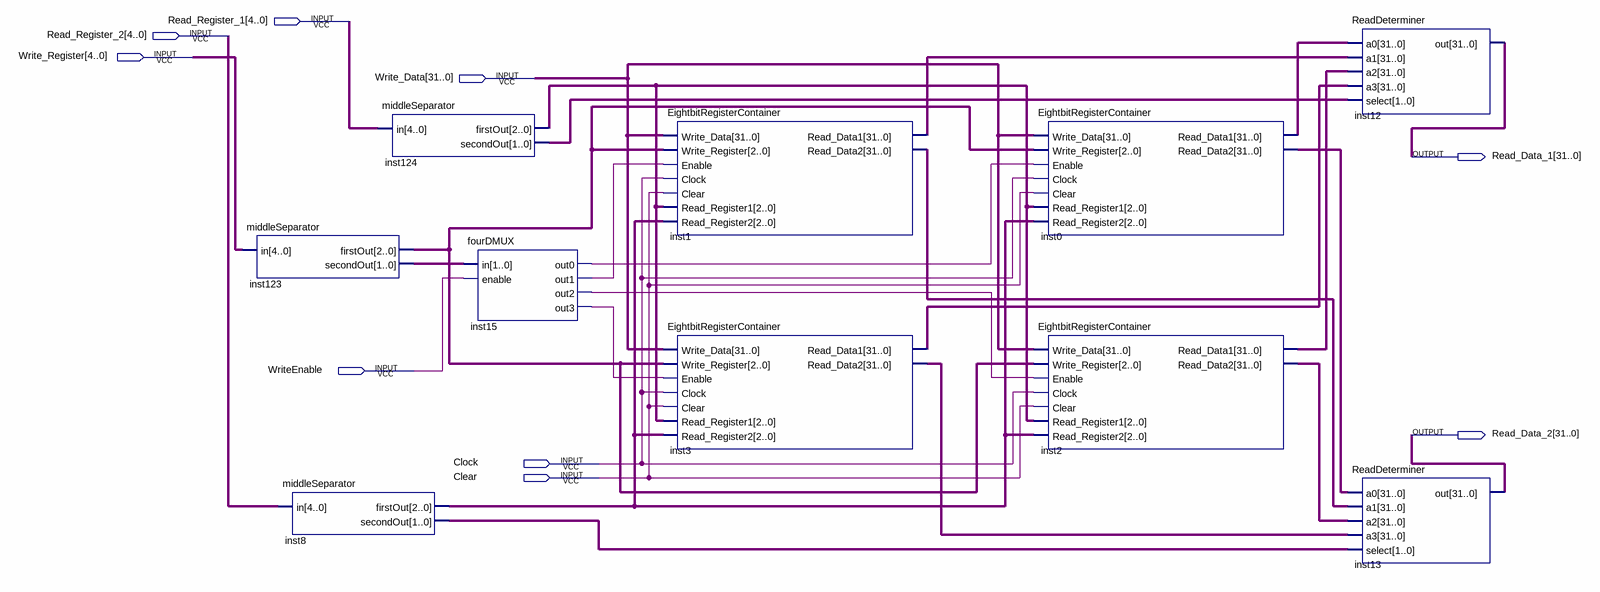
[diagram p0: schematic sheet]
// Quartus schematic RegisterFile.bdf as structural Verilog: 10 symbols, 9 pins
module RegisterFile (
  input  [4:0] Read_Register_1,
  input  [4:0] Read_Register_2,
  input  [4:0] Write_Register,
  input  [31:0] Write_Data,
  input  WriteEnable,
  input  Clock,
  input  Clear,
  output [31:0] Read_Data_1,
  output [31:0] Read_Data_2
);

  wire inst15_out0, inst15_out1, inst15_out2, inst15_out3;
  wire [1:0] inst8_secondout, inst123_secondout, inst124_secondout;
  wire [2:0] inst8_firstout, inst123_firstout, inst124_firstout;
  wire [31:0] inst0_read_data1, inst0_read_data2, inst1_read_data1, inst1_read_data2, inst2_read_data1,
       inst2_read_data2, inst3_read_data1, inst3_read_data2;

  middleSeparator inst123 (.in(Write_Register), .firstOut(inst123_firstout), .secondOut(inst123_secondout));
  middleSeparator inst8 (.in(Read_Register_2), .firstOut(inst8_firstout), .secondOut(inst8_secondout));
  middleSeparator inst124 (.in(Read_Register_1), .firstOut(inst124_firstout), .secondOut(inst124_secondout));
  fourDMUX inst15 (
    .in(inst123_secondout), .enable(WriteEnable), .out0(inst15_out0), .out1(inst15_out1), .out2(inst15_out2),
    .out3(inst15_out3));
  EightbitRegisterContainer inst1 (
    .Write_Data(Write_Data), .Write_Register(inst123_firstout), .Enable(inst15_out1), .Clock(Clock),
    .Clear(Clear), .Read_Register1(inst124_firstout), .Read_Register2(inst8_firstout),
    .Read_Data1(inst1_read_data1), .Read_Data2(inst1_read_data2));
  EightbitRegisterContainer inst3 (
    .Write_Data(Write_Data), .Write_Register(inst123_firstout), .Enable(inst15_out3), .Clock(Clock),
    .Clear(Clear), .Read_Register1(inst124_firstout), .Read_Register2(inst8_firstout),
    .Read_Data1(inst3_read_data1), .Read_Data2(inst3_read_data2));
  EightbitRegisterContainer inst0 (
    .Write_Data(Write_Data), .Write_Register(inst123_firstout), .Enable(inst15_out0), .Clock(Clock),
    .Clear(Clear), .Read_Register1(inst124_firstout), .Read_Register2(inst8_firstout),
    .Read_Data1(inst0_read_data1), .Read_Data2(inst0_read_data2));
  EightbitRegisterContainer inst2 (
    .Write_Data(Write_Data), .Write_Register(inst123_firstout), .Enable(inst15_out2), .Clock(Clock),
    .Clear(Clear), .Read_Register1(inst124_firstout), .Read_Register2(inst8_firstout),
    .Read_Data1(inst2_read_data1), .Read_Data2(inst2_read_data2));
  ReadDeterminer inst12 (
    .a0(inst0_read_data1), .a1(inst1_read_data1), .a2(inst2_read_data1), .a3(inst3_read_data1),
    .select(inst124_secondout), .out(Read_Data_1));
  ReadDeterminer inst13 (
    .a0(inst0_read_data2), .a1(inst1_read_data2), .a2(inst2_read_data2), .a3(inst3_read_data2),
    .select(inst8_secondout), .out(Read_Data_2));
endmodule
